# EAGLE design design (EAGLE 9.5.2)
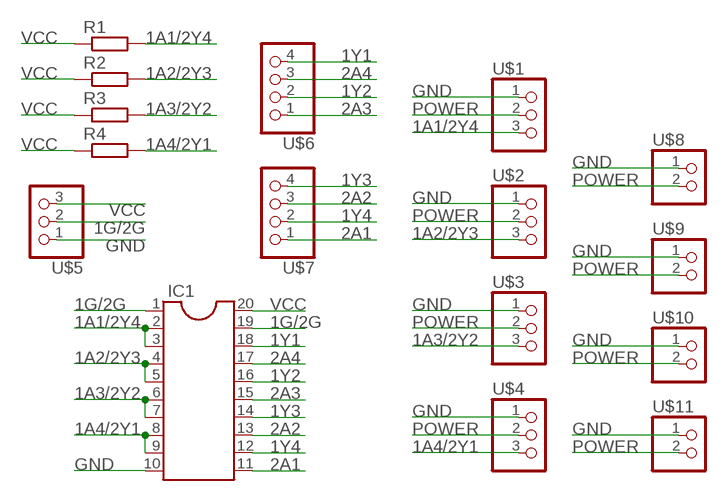
[diagram p0: schematic, sheet 1]

## Parts
IC1  DIL20  [DIL20]
R1  R-EU_0207/7  [0207/7]
R2  R-EU_0207/7  [0207/7]
R3  R-EU_0207/7  [0207/7]
R4  R-EU_0207/7  [0207/7]
U$1  ABOUTERS_3PIN  [22-23-2031]
U$2  ABOUTERS_3PIN  [22-23-2031]
U$3  ABOUTERS_3PIN  [22-23-2031]
U$4  ABOUTERS_3PIN  [22-23-2031]
U$5  ABOUTERS_3PIN  [22-23-2031]
U$6  ABOUTERS_4PIN  [22-23-2041]
U$7  ABOUTERS_4PIN  [22-23-2041]
U$8  ABOUTERS_2PIN  [22-23-2021]
U$9  ABOUTERS_2PIN  [22-23-2021]
U$10  ABOUTERS_2PIN  [22-23-2021]
U$11  ABOUTERS_2PIN  [22-23-2021]

## Nets
1A1/2Y4: IC1.2 IC1.3 R1.2 U$1.3
1A2/2Y3: IC1.4 IC1.5 R2.2 U$2.3
1A3/2Y2: IC1.6 IC1.7 R3.2 U$3.3
1A4/2Y1: IC1.8 IC1.9 R4.2 U$4.3
1G/2G: IC1.1 IC1.19 U$5.2
1Y1: IC1.18 U$6.4
1Y2: IC1.16 U$6.2
1Y3: IC1.14 U$7.4
1Y4: IC1.12 U$7.2
2A1: IC1.11 U$7.1
2A2: IC1.13 U$7.3
2A3: IC1.15 U$6.1
2A4: IC1.17 U$6.3
GND: IC1.10 U$1.1 U$2.1 U$3.1 U$4.1 U$5.1 U$8.1 U$9.1 U$10.1 U$11.1
POWER: U$1.2 U$2.2 U$3.2 U$4.2 U$8.2 U$9.2 U$10.2 U$11.2
VCC: IC1.20 R1.1 R2.1 R3.1 R4.1 U$5.3

## Library data of the parts
IC1 = ic-package:DIL20: Dual In Line / Socket
R1-R4 = rcl:R-EU_: RESISTOR, European symbol; SPICEPREFIX: R
U$1-U$5 = abouters_pin (1):ABOUTERS_3PIN
U$6 U$7 = abouters_pin (1):ABOUTERS_4PIN
U$8-U$11 = abouters_pin (1):ABOUTERS_2PIN

## Board
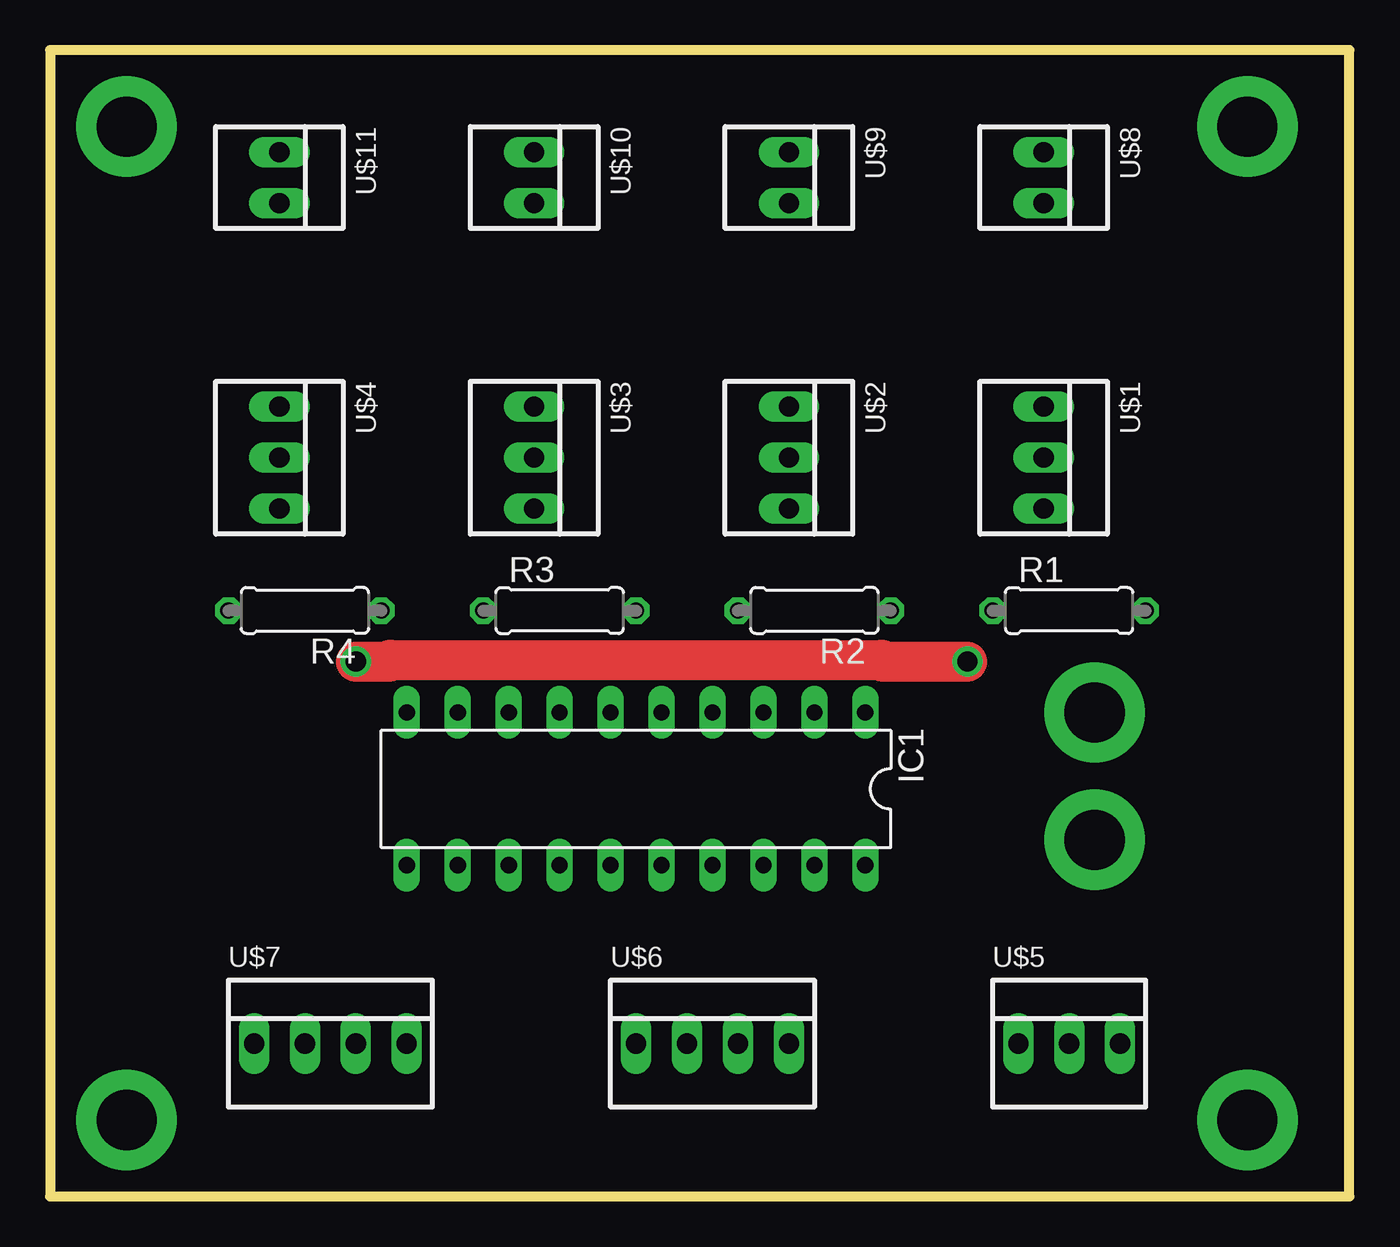
[diagram p1: board, top side]
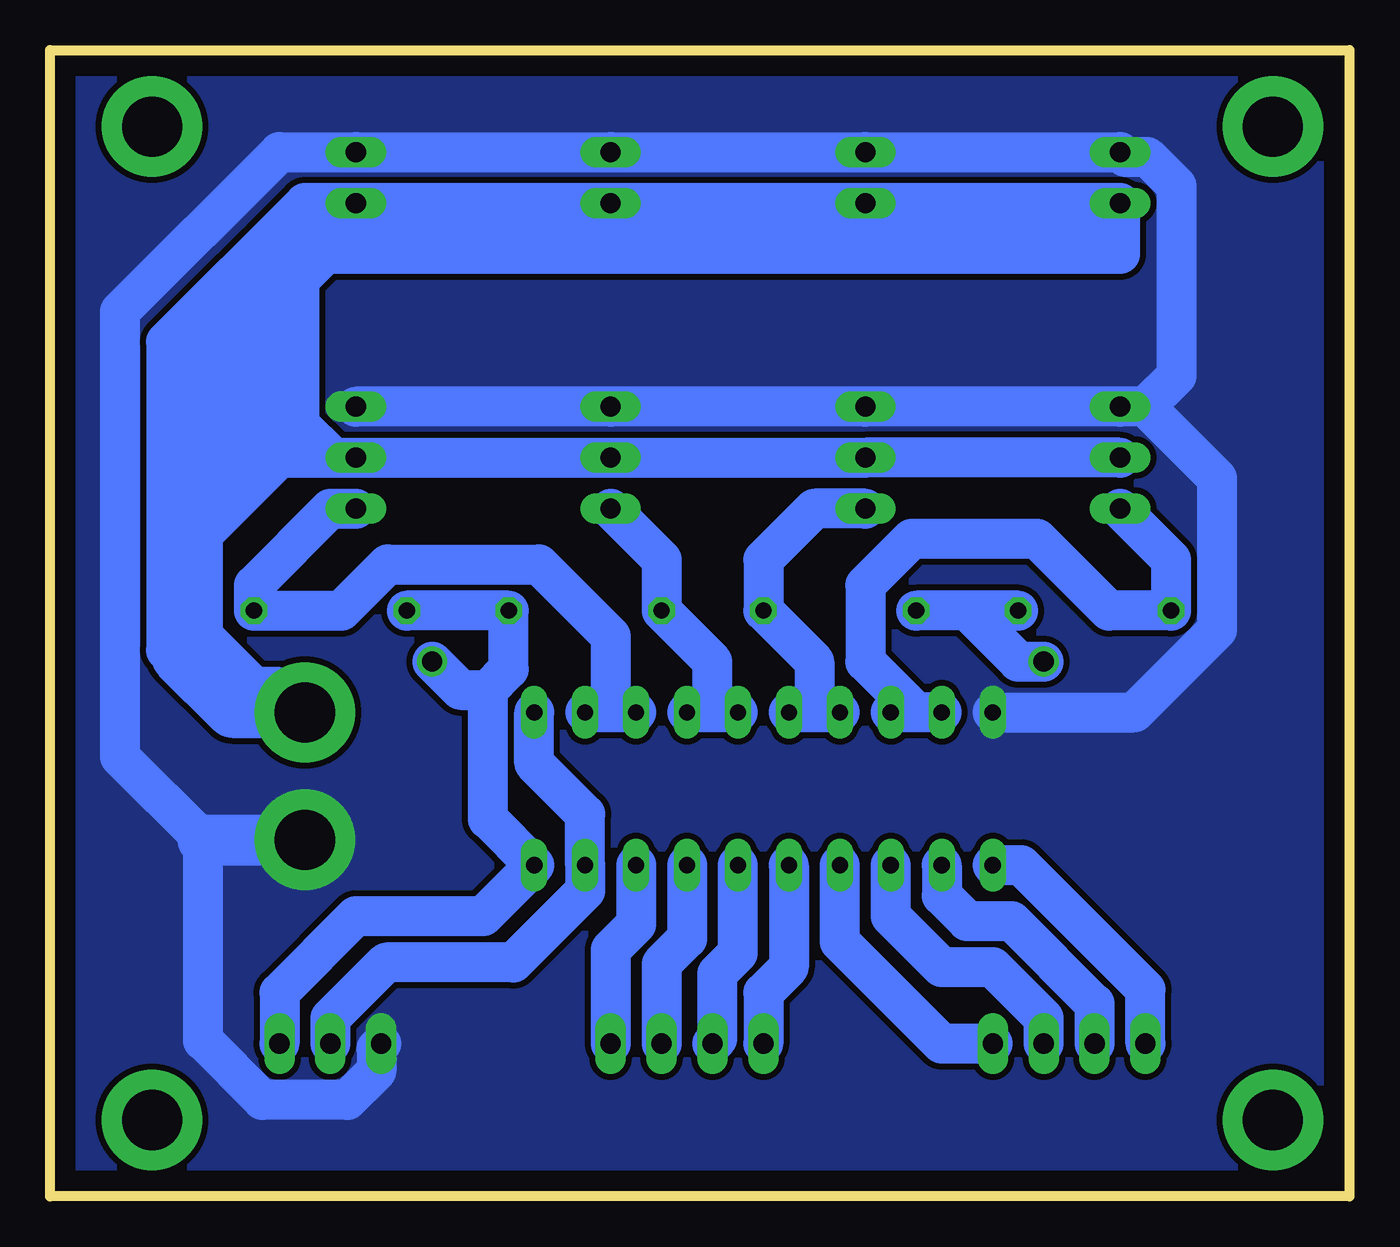
[diagram p2: board, bottom side, seen from below]

Size 64.77 x 57.15 mm. Coordinates in mm from the lower left corner, seen from the top.
Outline: 0,0 64.77,0 64.77,57.15 0,57.15 0,0
Copper layers (1*16): Top 0.035mm / dielectric 1.5mm / Bottom 0.035mm
Design rules "default *": minimum track width 6mil, minimum drill 0.35mm, track to track 0.3mm, track to pad 0.3mm, pad to pad 0.3mm, via to via 0.3mm, smd to smd 0.3mm, copper to edge 40mil, drill to drill 6mil, minimum pad ring 10mil, minimum via ring 8mil, stop-mask expansion 4mil, vias tented up to drill 0mil, thermal gap 10mil

### Footprints (pad centres in the part's own frame; a part is rotated, then mirrored left to right if it is on the bottom)
DIL20 = drill 0.813 long: 1 -11.43,-3.81; 2 -8.89,-3.81; 3 -6.35,-3.81; 4 -3.81,-3.81; 5 -1.27,-3.81; 6 1.27,-3.81; 7 3.81,-3.81; 8 6.35,-3.81; 9 8.89,-3.81; 10 11.43,-3.81; 11 11.43,3.81; 12 8.89,3.81; 13 6.35,3.81; 14 3.81,3.81; 15 1.27,3.81; 16 -1.27,3.81; 17 -3.81,3.81; 18 -6.35,3.81; 19 -8.89,3.81; 20 -11.43,3.81
0207/7 = drill 0.813 octagon: 1 -3.81,0; 2 3.81,0
22-23-2031 = drill 1 long: 1 -2.54,0; 2 0,0; 3 2.54,0
22-23-2041 = drill 1 long: 1 -3.81,0; 2 -1.27,0; 3 1.27,0; 4 3.81,0
22-23-2021 = drill 1 long: 1 -1.27,0; 2 1.27,0

### Placement (x,y rotation side)
IC1  29.21,20.32 180 top
R1  50.8,29.21 0 top
R2  38.1,29.21 180 top
R3  25.4,29.21 0 top
R4  12.7,29.21 180 top
U$1  49.53,36.83 270 top
U$2  36.83,36.83 270 top
U$3  24.13,36.83 270 top
U$4  11.43,36.83 270 top
U$5  50.8,7.62 0 top
U$6  33.02,7.62 0 top
U$7  13.97,7.62 0 top
U$8  49.53,50.8 270 top
U$9  36.83,50.8 270 top
U$10  24.13,50.8 270 top
U$11  11.43,50.8 270 top

### Tracks (layer width: path | path; a pad name or v marks a point on that pad's centre or on a via)
1A1/2Y4
  Bottom 2: IC1.3 36.83,24.13 | 36.83,24.13 IC1.2 | U$1.3 50.8,34.29 54.61,30.48 R1.2 50.24,29.21 47.94,31.51 40.4,31.51 36.83,27.94 36.83,24.13
1A2/2Y3
  Bottom 2: IC1.5 31.75,24.13 | 31.75,24.13 IC1.4 | U$2.3 34.29,31.75 R2.2 31.75,26.67 31.75,24.13
1A3/2Y2
  Bottom 2: IC1.7 26.67,24.13 | 26.67,24.13 IC1.6 | 26.67,24.13 26.67,26.67 R3.2 29.21,31.75 26.67,34.29 U$3.3
1A4/2Y1
  Bottom 2: IC1.9 21.59,24.13 | 21.59,24.13 IC1.8 | U$4.3 8.89,31.75 R4.2 11.99,29.21 15.56,32.78 21.83,32.78 24.13,30.48 24.13,26.67 21.59,24.13
1G/2G
  Bottom 2: IC1.1 40.64,21.59 38.1,19.05 IC1.19 38.1,15.24 41.67,11.67 48.02,11.67 50.8,8.89 U$5.2
1Y1
  Bottom 2: IC1.18 35.56,13.57 36.83,12.3 U$6.4
1Y2
  Bottom 2: U$6.2 31.51,7.86 31.51,11.11 30.48,12.14 IC1.16
1Y3
  Bottom 2: U$7.4 20.32,7.62 25.4,12.7 IC1.14
1Y4
  Bottom 2: IC1.12 20.32,15 19.05,13.73 16.83,13.73 12.7,9.6 U$7.2
2A1
  Bottom 2: U$7.1 10.16,10.31 16.36,16.51 IC1.11
2A2
  Bottom 2: U$7.3 15.24,8.89 17.78,11.43 20.32,11.43 22.86,13.97 IC1.13
2A3
  Bottom 2: IC1.15 27.94,11.43 29.21,10.16 U$6.1
2A4
  Bottom 2: IC1.17 33.02,12.85 34.29,11.58 U$6.3
GND  (via drill 3 pad 5)
  Bottom 2: U$1.1 U$2.1 U$3.1 U$4.1 10.16,39.37 | 10.16,39.37 8.62,40.91 8.62,50.38 10.07,51.83 11.19,51.83 U$11.1 U$10.1 U$9.1 U$8.1 53.34,52.07 61.29,44.12 61.29,21.92 57.15,17.78 57.15,7.77 54.19,4.81 49.95,4.81 48.5,6.26 48.5,7.38 U$5.1 | IC1.10 10.72,24.13 6.59,28.26 6.59,35.8 10.16,39.37
  Bottom 2.54: 57.15,17.78 v52.07,17.78
  pour Bottom (no thermals): -1.27,58.42 -1.27,-1.27 66.04,-1.27 66.04,58.42
N$1  (via drill 3 pad 5)
  other vias: 59.69,3.81
N$2  (via drill 3 pad 5)
  other vias: 59.69,53.34
N$3  (via drill 3 pad 5)
  other vias: 3.81,53.34
N$4  (via drill 3 pad 5)
  other vias: 3.81,3.81
POWER  (via drill 3 pad 5)
  Bottom 2: U$4.2 U$3.2 U$2.2 U$1.2 50.65,36.83 | U$11.2 U$10.2 U$9.2 U$8.2 | U$8.2 50.8,49.53 52.34,47.99 | 50.65,36.83 52.34,38.52 52.34,45.72 | 52.34,45.72 52.34,47.99 | 12.97,47.99 52.34,47.99 | U$11.2 12.97,47.99 | v52.07,24.13 53.34,25.4 54.61,25.4 57.15,27.94 57.15,33.02 53.34,36.83 50.65,36.83 | 12.97,47.99 13.97,46.99 | 52.34,45.72 51.07,46.99 13.97,46.99 | U$8.2 52.07,49.53 58.99,42.61 58.99,27.24 58.42,26.67 58.42,26.85 58.45,26.88 | U$11.2 11.43,46.99 13.97,46.99
  Bottom 2.54: v52.07,24.13 55.7,24.13 58.45,26.88 58.45,32.99 53.11,38.33 52.53,38.33 52.61,38.41 52.61,47.72 | 52.34,47.99 52.61,47.72 | 52.61,47.72 54.61,45.72 | 54.61,45.72 54.61,38.1 58.45,34.26 | 54.61,45.72 57.15,43.18 | 58.42,35.56 57.15,36.83 57.15,43.18 | 58.42,35.56 58.45,35.59 58.45,41.91 57.18,43.18 57.15,43.18 | 58.42,35.56 58.45,35.53 58.45,34.26 | 58.45,34.26 58.45,33.02
VCC  (via drill 1)
  Top 2: v15.24,26.67 16.89,26.67 16.97,26.75 41.45,26.75 41.53,26.67 v45.72,26.67
  Bottom 2: U$5.3 53.34,10.16 49.53,13.97 43.18,13.97 IC1.20 42.94,18.81 42.94,25.26 | R4.1 19.05,29.21 | 19.05,29.21 R3.1 | 42.94,25.26 41.91,26.29 R2.1 R1.1 | 19.05,29.21 16.51,26.67 v15.24,26.67 | v45.72,26.67 44.31,25.26 42.94,25.26